# Altium project Alyssa Night Light.PrjPcb
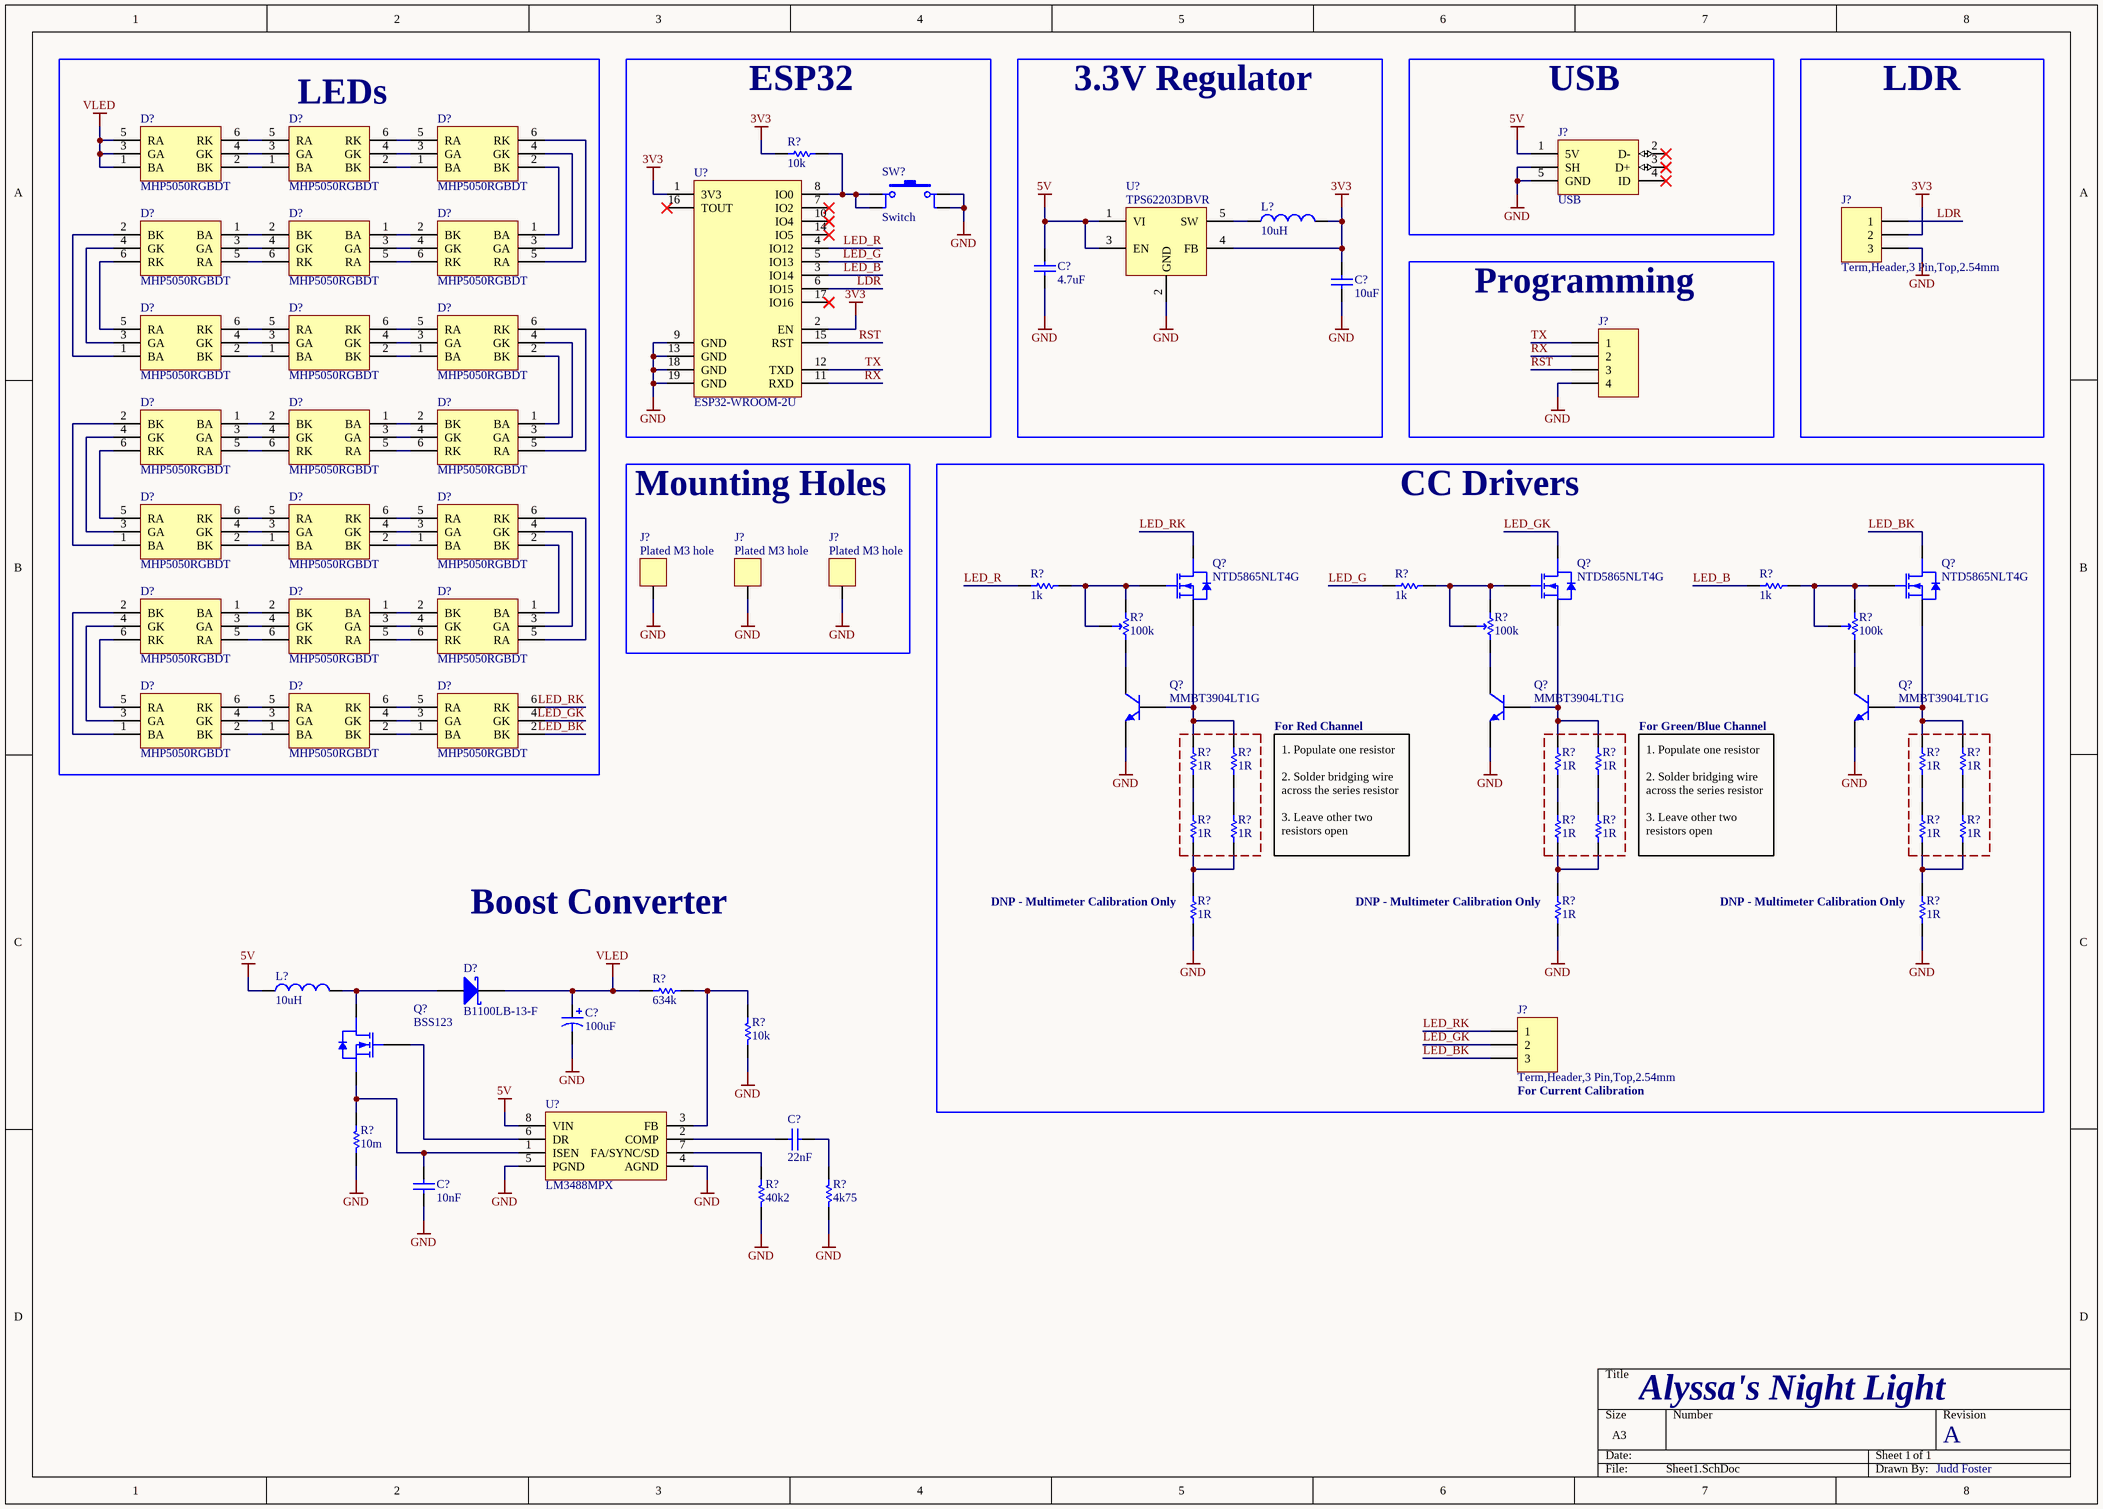
[diagram p0: Sheet1.SchDoc]
1 sheet, 74 parts. Net scope: global (net labels, ports and power ports of the same name join across sheets).
Board file: PCB1.PcbDoc

## Sheet Sheet1.SchDoc: Alyssa's Night Light
size A3; Author: Judd Foster; DrawnBy: Judd Foster; Engineer: Judd Foster; Organization: Altium Limited; Address1: L3, 12a Rodborough Rd; Address2: Frenchs Forest; Address3: NSW; Address4: Australia 2086; Revision: A; SheetNumber: 1; SheetTotal: 1

### Parts
(Parts that share a designator on the sheet are numbered #1, #2 ... from top to bottom, then left to right.)
C?#1  4.7uF  [Cap,SMD,0805]
C?#2  10uF  [Cap,SMD,0805]
C?#3  100uF
C?#4  22nF  [Cap,SMD,0603]
C?#5  10nF  [Cap,SMD,0603]
D?#1  MHP5050RGBDT  [LED,RGB,SMD,5050]
D?#2  MHP5050RGBDT  [LED,RGB,SMD,5050]
D?#3  MHP5050RGBDT  [LED,RGB,SMD,5050]
D?#4  MHP5050RGBDT  [LED,RGB,SMD,5050]
D?#5  MHP5050RGBDT  [LED,RGB,SMD,5050]
D?#6  MHP5050RGBDT  [LED,RGB,SMD,5050]
D?#7  MHP5050RGBDT  [LED,RGB,SMD,5050]
D?#8  MHP5050RGBDT  [LED,RGB,SMD,5050]
D?#9  MHP5050RGBDT  [LED,RGB,SMD,5050]
D?#10  MHP5050RGBDT  [LED,RGB,SMD,5050]
D?#11  MHP5050RGBDT  [LED,RGB,SMD,5050]
D?#12  MHP5050RGBDT  [LED,RGB,SMD,5050]
D?#13  MHP5050RGBDT  [LED,RGB,SMD,5050]
D?#14  MHP5050RGBDT  [LED,RGB,SMD,5050]
D?#15  MHP5050RGBDT  [LED,RGB,SMD,5050]
D?#16  MHP5050RGBDT  [LED,RGB,SMD,5050]
D?#17  MHP5050RGBDT  [LED,RGB,SMD,5050]
D?#18  MHP5050RGBDT  [LED,RGB,SMD,5050]
D?#19  MHP5050RGBDT  [LED,RGB,SMD,5050]
D?#20  MHP5050RGBDT  [LED,RGB,SMD,5050]
D?#21  MHP5050RGBDT  [LED,RGB,SMD,5050]
D?#22  B1100LB-13-F
J?#1  USB  [Conn,USB,MicroB,SMD]
J?#2  Term,Header,3 Pin,Top,2.54mm  [Term,Header,3Pin,2.54mm]
J?#3  Term,Header,4 Pin,Top,2.54mm  [Term,Header,4Pin,2.54mm]  (value not drawn)
J?#4  Plated M3 hole  [HOLE,M3,3mm,PLATED]
J?#5  Plated M3 hole  [HOLE,M3,3mm,PLATED]
J?#6  Plated M3 hole  [HOLE,M3,3mm,PLATED]
J?#7  Term,Header,3 Pin,Top,2.54mm  [Term,Header,3Pin,2.54mm]
L?#1  10uH  [IND,Wirewound,4x4,SMD]
L?#2  10uH  [IND,Wirewound,4x4,SMD]
Q?#1  NTD5865NLT4G  [DPAK3 (TO-252 3 Lead)]
Q?#2  NTD5865NLT4G  [DPAK3 (TO-252 3 Lead)]
Q?#3  NTD5865NLT4G  [DPAK3 (TO-252 3 Lead)]
Q?#4  MMBT3904LT1G  [SOT23-3]
Q?#5  MMBT3904LT1G  [SOT23-3]
Q?#6  MMBT3904LT1G  [SOT23-3]
Q?#7  BSS123  [SOT23-3]
R?#1  10k  [RES,0603]
R?#2  1k  [RES,0603]
R?#3  1k  [RES,0603]
R?#4  1k  [RES,0603]
R?#5  100k
R?#6  100k
R?#7  100k
R?#8  1R  [RES,1206]
R?#9  1R  [RES,1206]
R?#10  1R  [RES,1206]
R?#11  1R  [RES,1206]
R?#12  1R  [RES,1206]
R?#13  1R  [RES,1206]
R?#14  1R  [RES,1206]
R?#15  1R  [RES,1206]
R?#16  1R  [RES,1206]
R?#17  1R  [RES,1206]
R?#18  1R  [RES,1206]
R?#19  1R  [RES,1206]
R?#20  1R  [RES,1206]
R?#21  1R  [RES,1206]
R?#22  1R  [RES,1206]
R?#23  634k  [RES,0603]
R?#24  10k  [RES,0603]
R?#25  10m  [RES,1206]
R?#26  40k2  [RES,0603]
R?#27  4k75  [RES,0603]
SW?  Switch  [Switch,Tactile,SPST-NO,SMD]
U?#1  ESP32-WROOM-2U  [ESP32-WROOM-02U]
U?#2  TPS62203DBVR  [SOT23-5]
U?#3  LM3488MPX

### Blocks framed on the sheet
LEDs: D?#1-D?#21
ESP32: R?#1 SW? U?#1
3.3V Regulator: C?#1 C?#2 L?#1 U?#2
USB: J?#1
LDR: J?#2
Programming: J?#3
Mounting Holes: J?#4-J?#6
CC Drivers: J?#7 Q?#1-Q?#6 R?#2-R?#22

### Nets
3V3: C?#2.2 J?#2.2 L?#1.2 R?#1.2 U?#1.1(3V3) U?#1.2(EN) U?#2.4(FB)
5V: C?#1.2 J?#1.1(5V) L?#2.1 U?#2.1(VI) U?#2.3(EN) U?#3.8(VIN)
GND: C?#1.1 C?#2.1 C?#3.2 C?#5.1 J?#1.0(SH) J?#1.5(GND) J?#2.3 J?#3.4 J?#4.0(PIN) J?#5.0(PIN) J?#6.0(PIN) Q?#4.2(E) Q?#5.2(E) Q?#6.2(E) R?#20.1 R?#21.1 R?#22.1 R?#24.1 R?#25.2 R?#26.1 R?#27.1 SW?.3 SW?.4 U?#1.9(GND) U?#1.13(GND) U?#1.18(GND) U?#1.19(GND) U?#2.2(GND) U?#3.4(AGND) U?#3.5(PGND)
VLED: C?#3.1 D?#1.1(BA) D?#1.3(GA) D?#1.5(RA) D?#22.1(K) R?#23.1
LDR: J?#2.1 U?#1.6(IO15)
LED_B: R?#4.1 U?#1.3(IO14)
LED_BK: D?#21.2(BK) J?#7.3 Q?#3.4(D)
LED_G: R?#3.1 U?#1.5(IO13)
LED_GK: D?#21.4(GK) J?#7.2 Q?#2.4(D)
LED_R: R?#2.1 U?#1.4(IO12)
LED_RK: D?#21.6(RK) J?#7.1 Q?#1.4(D)
RST: J?#3.3 U?#1.15(RST)
RX: J?#3.2 U?#1.11(RXD)
TX: J?#3.1 U?#1.12(TXD)
NetC?#4_1: C?#4.1 R?#27.2
NetC?#4_2: C?#4.2 U?#3.2(COMP)
NetC?#5_2: C?#5.2 Q?#7.2(S) R?#25.1 U?#3.1(ISEN)
NetD?#1_2: D?#1.2(BK) D?#2.1(BA)
NetD?#1_4: D?#1.4(GK) D?#2.3(GA)
NetD?#1_6: D?#1.6(RK) D?#2.5(RA)
NetD?#2_2: D?#2.2(BK) D?#3.1(BA)
NetD?#2_4: D?#2.4(GK) D?#3.3(GA)
NetD?#2_6: D?#2.6(RK) D?#3.5(RA)
NetD?#3_2: D?#3.2(BK) D?#6.1(BA)
NetD?#3_4: D?#3.4(GK) D?#6.3(GA)
NetD?#3_6: D?#3.6(RK) D?#6.5(RA)
NetD?#4_1: D?#4.1(BA) D?#5.2(BK)
NetD?#4_2: D?#4.2(BK) D?#7.1(BA)
NetD?#4_3: D?#4.3(GA) D?#5.4(GK)
NetD?#4_4: D?#4.4(GK) D?#7.3(GA)
NetD?#4_5: D?#4.5(RA) D?#5.6(RK)
NetD?#4_6: D?#4.6(RK) D?#7.5(RA)
NetD?#5_1: D?#5.1(BA) D?#6.2(BK)
NetD?#5_3: D?#5.3(GA) D?#6.4(GK)
NetD?#5_5: D?#5.5(RA) D?#6.6(RK)
NetD?#7_2: D?#7.2(BK) D?#8.1(BA)
NetD?#7_4: D?#7.4(GK) D?#8.3(GA)
NetD?#7_6: D?#7.6(RK) D?#8.5(RA)
NetD?#8_2: D?#8.2(BK) D?#9.1(BA)
NetD?#8_4: D?#8.4(GK) D?#9.3(GA)
NetD?#8_6: D?#8.6(RK) D?#9.5(RA)
NetD?#9_2: D?#9.2(BK) D?#12.1(BA)
NetD?#9_4: D?#9.4(GK) D?#12.3(GA)
NetD?#9_6: D?#9.6(RK) D?#12.5(RA)
NetD?#10_1: D?#10.1(BA) D?#11.2(BK)
NetD?#10_2: D?#10.2(BK) D?#13.1(BA)
NetD?#10_3: D?#10.3(GA) D?#11.4(GK)
NetD?#10_4: D?#10.4(GK) D?#13.3(GA)
NetD?#10_5: D?#10.5(RA) D?#11.6(RK)
NetD?#10_6: D?#10.6(RK) D?#13.5(RA)
NetD?#11_1: D?#11.1(BA) D?#12.2(BK)
NetD?#11_3: D?#11.3(GA) D?#12.4(GK)
NetD?#11_5: D?#11.5(RA) D?#12.6(RK)
NetD?#13_2: D?#13.2(BK) D?#14.1(BA)
NetD?#13_4: D?#13.4(GK) D?#14.3(GA)
NetD?#13_6: D?#13.6(RK) D?#14.5(RA)
NetD?#14_2: D?#14.2(BK) D?#15.1(BA)
NetD?#14_4: D?#14.4(GK) D?#15.3(GA)
NetD?#14_6: D?#14.6(RK) D?#15.5(RA)
NetD?#15_2: D?#15.2(BK) D?#18.1(BA)
NetD?#15_4: D?#15.4(GK) D?#18.3(GA)
NetD?#15_6: D?#15.6(RK) D?#18.5(RA)
NetD?#16_1: D?#16.1(BA) D?#17.2(BK)
NetD?#16_2: D?#16.2(BK) D?#19.1(BA)
NetD?#16_3: D?#16.3(GA) D?#17.4(GK)
NetD?#16_4: D?#16.4(GK) D?#19.3(GA)
NetD?#16_5: D?#16.5(RA) D?#17.6(RK)
NetD?#16_6: D?#16.6(RK) D?#19.5(RA)
NetD?#17_1: D?#17.1(BA) D?#18.2(BK)
NetD?#17_3: D?#17.3(GA) D?#18.4(GK)
NetD?#17_5: D?#17.5(RA) D?#18.6(RK)
NetD?#19_2: D?#19.2(BK) D?#20.1(BA)
NetD?#19_4: D?#19.4(GK) D?#20.3(GA)
NetD?#19_6: D?#19.6(RK) D?#20.5(RA)
NetD?#20_2: D?#20.2(BK) D?#21.1(BA)
NetD?#20_4: D?#20.4(GK) D?#21.3(GA)
NetD?#20_6: D?#20.6(RK) D?#21.5(RA)
NetD?#22_2: D?#22.2(A) L?#2.2 Q?#7.3(D)
NetL?#1_1: L?#1.1 U?#2.5(SW)
NetQ?#1_1: Q?#1.1(G) R?#2.2 R?#5.1
NetQ?#1_3: Q?#1.3(S) Q?#4.1(B) R?#8.2 R?#9.2
NetQ?#2_1: Q?#2.1(G) R?#3.2 R?#6.1
NetQ?#2_3: Q?#2.3(S) Q?#5.1(B) R?#10.2 R?#11.2
NetQ?#3_1: Q?#3.1(G) R?#4.2 R?#7.1
NetQ?#3_3: Q?#3.3(S) Q?#6.1(B) R?#12.2 R?#13.2
NetQ?#4_3: Q?#4.3(C) R?#5.2
NetQ?#5_3: Q?#5.3(C) R?#6.2
NetQ?#6_3: Q?#6.3(C) R?#7.2
NetQ?#7_1: Q?#7.1(G) U?#3.6(DR)
NetR?#1_1: R?#1.1 SW?.1 SW?.2 U?#1.8(IO0)
NetR?#8_1: R?#8.1 R?#14.2
NetR?#9_1: R?#9.1 R?#15.2
NetR?#10_1: R?#10.1 R?#16.2
NetR?#11_1: R?#11.1 R?#17.2
NetR?#12_1: R?#12.1 R?#18.2
NetR?#13_1: R?#13.1 R?#19.2
NetR?#14_1: R?#14.1 R?#15.1 R?#20.2
NetR?#16_1: R?#16.1 R?#17.1 R?#21.2
NetR?#18_1: R?#18.1 R?#19.1 R?#22.2
NetR?#23_2: R?#23.2 R?#24.2 U?#3.3(FB)
NetR?#26_2: R?#26.2 U?#3.7(FA/SYNC/SD)

Not connected (* = marked no-connect by the designer): J?#1 2(D-)* 3(D+)* 4(ID)*; U?#1 7(IO2)* 10(IO4)* 14(IO5)* 16(TOUT)* 17(IO16)*

### Notes on the sheet
- (near R?#9) For Red Channel
- (near R?#11) For Green/Blue Channel
- (near R?#9) 1. Populate one resistor
  2. Solder bridging wire across the series resistor
  3. Leave other two resistors open
- (near R?#11) 1. Populate one resistor
  2. Solder bridging wire across the series resistor
  3. Leave other two resistors open
- Boost Converter
- (near R?#20) DNP - Multimeter Calibration Only
- (near R?#21) DNP - Multimeter Calibration Only
- (near R?#22) DNP - Multimeter Calibration Only
- (near J?#7) For Current Calibration
- Title
- Size:
- Date:
- A3
- Revision:
- Sheet
- of
- Design By:

### Library data of the parts
C?#1 = CAP,Cer,4.7uF,16VDC,X7R,0805: 4.7µF ±10% 16V Ceramic Capacitor X7R 0805 (2012 Metric); Vendor Part Number: 490-14466-1-ND; Manufacturer: KEMET; Manufacturer Part Number: GRM21BR71C475KE51L; Vendor: Digikey; HelpURL: https://search.murata.co.jp/Ceramy/image/img/A01X/G101/ENG/GRM21BR71C475KE51-01.pdf; CreatedBy: Judd Foster
C?#2 = CAP,Cer,10uF,10VDC,X5R,0805: CAP CER 10UF 10V X5R 0805; Vendor Part Number: 399-4925-1-ND; Manufacturer: KEMET; Manufacturer Part Number: C0805C106K8PACTU; Vendor: Digikey; HelpURL: https://content.kemet.com/datasheets/KEM_C1006_X5R_SMD.pdf; CreatedBy: Judd Foster
C?#3 = CAP,Alum,100uF,100VDC,SMD: 100µF 100V Aluminum Electrolytic Capacitors Radial, Can - SMD  5000 Hrs @ 105°C; Vendor Part Number: 565-2511-1-ND; Manufacturer: United Chemi-Con; Manufacturer Part Number: EMVY101ARA101MKE0S; Vendor: Digikey; HelpURL: http://www.chemi-con.co.jp/cgi-bin/CAT_DB/SEARCH/cat_db_al.cgi?e=e&j=p&pdfname=mvy; CreatedBy: Judd Foster
C?#4 = CAP,Cer,22nF,100VDC,X7R,0603: 0.022µF ±10% 100V Ceramic Capacitor X7R 0603 (1608 Metric); Vendor Part Number: 1276-CL10B223KC8WPNCCT-ND; Manufacturer: Samsung Electro-MechanicsYageo; Manufacturer Part Number: CL10B223KC8WPNC; Vendor: Digikey; HelpURL: http://www.samsungsem.com/kr/support/product-search/mlcc/__icsFiles/afieldfile/2019/08/26/CL10B223KC8WPNC-19.pdf; CreatedBy: Judd Foster
C?#5 = CAP,Cer,10nF,50VDC,X7R,0603: 10000pF ±10% 50V Ceramic Capacitor X7R 0603 (1608 Metric); Vendor Part Number: 311-1572-1-ND; Manufacturer: Yageo; Manufacturer Part Number: CC0603KPX7R9BB103; Vendor: Digikey; HelpURL: https://www.yageo.com/upload/media/product/productsearch/datasheet/mlcc/UPY-GPHC_X7R_6.3V-to-50V_18.pdf; CreatedBy: Judd Foster
D?#1-D?#21 = LED,Tri-Color,RGB,SMD,5050: SMD,5x5mm Light Emitting Diodes (LED) RoHS; Manufacturer: MEIHUA; Vendor Part Number: C409780; Vendor: LCSC; CreatedBy: Judd Foster; HelpURL: https://datasheet.lcsc.com/szlcsc/1912111437_MEIHUA-MHP5050RGBDT_C409780.pdf; Manufacturer Part Number: MHP5050RGBDT
D?#22 = DIODE,Schottky,100V,1A,SMD: Diode Schottky 100V 1A Surface Mount SMB; Manufacturer: Diodes Incorporated; Vendor Part Number: B1100LB-FDICT-ND; Vendor: Digikey; CreatedBy: Judd Foster; HelpURL: https://www.diodes.com/assets/Datasheets/ds30077.pdf; Manufacturer Part Number: B1100LB-13-F
J?#1 = Conn,USB.Micro_B,SMD: USB - micro B USB 2.0 Receptacle Connector 5 Position Surface Mount, Right Angle; Through Hole; Manufacturer: Amphenol ICC (FCI); Manufacturer Part Number: 10118193-0001LF; Vendor Part Number: 609-4616-1-ND; Vendor: Digikey; CreatedBy: Judd Foster; HelpURL: https://cdn.amphenol-icc.com/media/wysiwyg/files/documentation/datasheet/inputoutput/io_usb_micro.pdf
J?#2 J?#7 = Term,Header,3 Pin,Top,2.54mm: CONN HEADER VERT 3POS 2.54MM; Vendor Part Number: 732-5316-ND; Manufacturer: Würth Elektronik; Manufacturer Part Number: 61300311121; Vendor: Digikey; HelpURL: https://katalog.we-online.de/em/datasheet/6130xx11121.pdf; Created By: Judd Foster
J?#3 = Term,Header,4 Pin,Top,2.54mm: Connector Header Through Hole 4 position 0.100" (2.54mm); Vendor Part Number: 609-10082627-404HLF-ND; Manufacturer: Amphenol ICC (FCI); Manufacturer Part Number: 10082627-404HLF; Vendor: Digikey; HelpURL: https://cdn.amphenol-icc.com/media/wysiwyg/files/drawing/10082627.pdf; Created By: Judd Foster
J?#4-J?#6 = Mech,Hole,M3,3mm,Plated: 3.5mm Drill, 7.4mm Pad, PTH; CreatedBy: Judd Foster; HelpURL: N/A; Manufacturer: N/A; Manufacturer Part Number: N/A; Vendor: N/A; Vendor Part Number: N/A
L?#1 L?#2 = IND,10uH,1.17A,Wirewound,SMD: FIXED IND 10UH 1.17A 160 MOHM; Vendor Part Number: ‎490-5330-1-ND‎; Manufacturer: Murata Electronics; Manufacturer Part Number: LQH44PN100MP0L; Vendor: Digikey; HelpURL: https://search.murata.co.jp/Ceramy/image/img/P02/JELF243A-0069.pdf; CreatedBy: Judd Foster
Q?#1-Q?#3 = MOSFET,N Ch,60V,46A: MOSFET N-CH 60V 46A DPAK; Manufacturer: ON Semiconductor; Vendor Part Number: NTD5865NLT4GOSCT-ND; Vendor: Digikey; CreatedBy: Judd Foster; HelpURL: https://www.onsemi.com/pub/Collateral/NTD5865NL-D.PDF; Manufacturer Part Number: NTD5865NLT4G
Q?#4-Q?#6 = Trans,NPN,40V,200mA,SMD: TRANS NPN 40V 0.2A SOT23; Manufacturer: ON Semiconductor; Vendor Part Number: MMBT3904LT1GOSCT-ND; Vendor: Digikey; CreatedBy: Judd Foster; HelpURL: https://www.onsemi.com/pub/Collateral/MMBT3904LT1-D.PDF; Manufacturer Part Number: MMBT3904LT1G
Q?#7 = MOSFET,N Ch,100V,150mA: N-Channel 100V 150mA (Ta) 250mW (Ta) Surface Mount TO-236AB; Manufacturer: Nexperia USA Inc.; Manufacturer Part Number: BSS123,215; Vendor Part Number: 1727-4246-1-ND; Vendor: Digikey; CreatedBy: Judd Foster; HelpURL: https://assets.nexperia.com/documents/data-sheet/BSS123.pdf
R?#1 R?#24 = RES,10k,1%,0.1W,0603: RES SMD 10K OHM 1% 1/10W 0603; Manufacturer: Yageo; Manufacturer Part Number: RC0603FR-0710KL; Vendor Part Number: 311-10.0KHRCT-ND; Vendor: Digikey; CreatedBy: Judd Foster; HelpURL: https://www.yageo.com/upload/media/product/productsearch/datasheet/rchip/PYu-RC_Group_51_RoHS_L_10.pdf
R?#2-R?#4 = RES,1k,1%,0.1W,0603: RES SMD 1K OHM 1% 1/10W 0603; Manufacturer: Yageo; Manufacturer Part Number: RC0603FR-071KL; Vendor Part Number: 311-1.00KHRCT-ND; Vendor: Digikey; CreatedBy: Judd Foster; HelpURL: https://www.yageo.com/upload/media/product/productsearch/datasheet/rchip/PYu-RC_Group_51_RoHS_L_10.pdf
R?#5-R?#7 = RES,Trim,15T,100k,0.75W,Side-Adj,Thru: 100 kOhms 0.75W, 3/4W PC Pins Through Hole Trimmer Potentiometer Cermet 15 Turn Side Adjustment; Vendor Part Number: 716-1198-ND; Manufacturer: Vishay Sfernice; Manufacturer Part Number: T18104KT10; Vendor: DIgikey; HelpURL: https://www.vishay.com/docs/51027/t18.pdf; CreatedBy: Judd Foster
R?#8-R?#22 = RES,1R,5%,0.25W,1206: 1 Ohms ±5% 0.25W, 1/4W Chip Resistor 1206 (3216 Metric) Moisture Resistant Thick Film; Manufacturer: Bourns Inc.; Manufacturer Part Number: CR1206-J/-1R0ELF; Vendor Part Number: 118-CR1206-J/-1R0ELFCT-ND; Vendor: Digikey; CreatedBy: Judd Foster; HelpURL: https://www.bourns.com/docs/product-datasheets/CRxxxxx.pdf
R?#23 = RES,634k,1%,0.1W,0603: 634 kOhms ±1% 0.1W, 1/10W Chip Resistor 0603 (1608 Metric) Moisture Resistant Thick Film; Manufacturer: Yageo; Manufacturer Part Number: RC0603FR-07634KL; Vendor Part Number: 311-634KHRCT-ND; Vendor: Digikey; CreatedBy: Judd Foster; HelpURL: https://www.yageo.com/upload/media/product/productsearch/datasheet/rchip/PYu-RC_Group_51_RoHS_L_11.pdf
R?#25 = RES,10m,1%,1W,1206: RES 0.01 OHM 1% 1W 1206; Manufacturer: Stackpole Electronics Inc; Manufacturer Part Number: CSRF1206FT10L0; Vendor Part Number: CSRF1206FT10L0CT-ND; Vendor: Digikey; CreatedBy: Judd Foster; HelpURL: https://www.seielect.com/catalog/sei-csrf.pdf
R?#26 = RES,40k2,0.5%,0.1W,0603: 40.2 kOhms ±0.5% 0.1W, 1/10W Chip Resistor 0603 (1608 Metric)  Thin Film; Manufacturer: Yageo; Manufacturer Part Number: RT0603DRE0740K2L; Vendor Part Number: 311-2575-1-ND; Vendor: Digikey; CreatedBy: Judd Foster; HelpURL: https://www.yageo.com/upload/media/product/productsearch/datasheet/rchip/PYu-RT_1-to-0.01_RoHS_L_12.pdf
R?#27 = RES,4k75,1%,0.1W,0603: 4.75 kOhms ±1% 0.1W, 1/10W Chip Resistor 0603 (1608 Metric) Moisture Resistant Thick Film; Manufacturer: Yageo; Manufacturer Part Number: RC0603FR-074K75L; Vendor Part Number: 311-4.75KHRCT-ND; Vendor: Digikey; CreatedBy: Judd Foster; HelpURL: https://www.yageo.com/upload/media/product/productsearch/datasheet/rchip/PYu-RC_Group_51_RoHS_L_10.pdf
SW? = Switch,Tactile,SPST-NO,SMD,H4.3: Tactile Switch SPST-NO Top Actuated Surface Mount; Manufacturer: C&K; Manufacturer Part Number: PTS645SK43SMTR92 LFS; Vendor Part Number: CKN9084CT-ND; Vendor: Digikey; CreatedBy: Judd Foster; HelpURL: https://dznh3ojzb2azq.cloudfront.net/products/Tactile/PTS645/documents/datasheet.pdf
U?#1 = ESP32-WROOM-2U: WiFi 802.11b/g/n Transceiver Module 2.4GHz ~ 2.5GHz Integrated, Chip + IPEX Surface Mount; Manufacturer: Espressif Systems; Manufacturer Part Number: ESP-WROOM-02U (4MB); Vendor Part Number: 1965-ESP-WROOM-02U(4MB)CT-ND; Vendor: Digikey; CreatedBy: Judd Foster; HelpURL: https://www.espressif.com/sites/default/files/documentation/esp-wroom-02u_esp-wroom-02d_datasheet_en.pdf
U?#2 = TPS62203DBVR: IC REG BUCK 3.3V 300MA SOT23-5; Manufacturer: Texas Instruments; Vendor Part Number: 296-39452-1-ND; Vendor: Digikey; CreatedBy: Judd Foster; HelpURL: http://www.ti.com/lit/ds/symlink/tps62203.pdf; Manufacturer Part Number: TPS62203DBVR
U?#3 = LM3488MMX: Boost, Flyback, SEPIC Regulator Positive Output Step-Up, Step-Up/Step-Down  DC-DC Controller IC 8-VSSOP; Manufacturer: Texas Instruments; Manufacturer Part Number: LM3488MMX/NOPB; Vendor Part Number: 296-35417-1-ND; Vendor: Digikey; CreatedBy: Judd Foster; HelpURL: https://www.ti.com/lit/ds/symlink/lm3488.pdf?ts=1614751145047&ref_url=https%253A%252F%252Fwww.ti.com%252Fproduct%252FLM3488